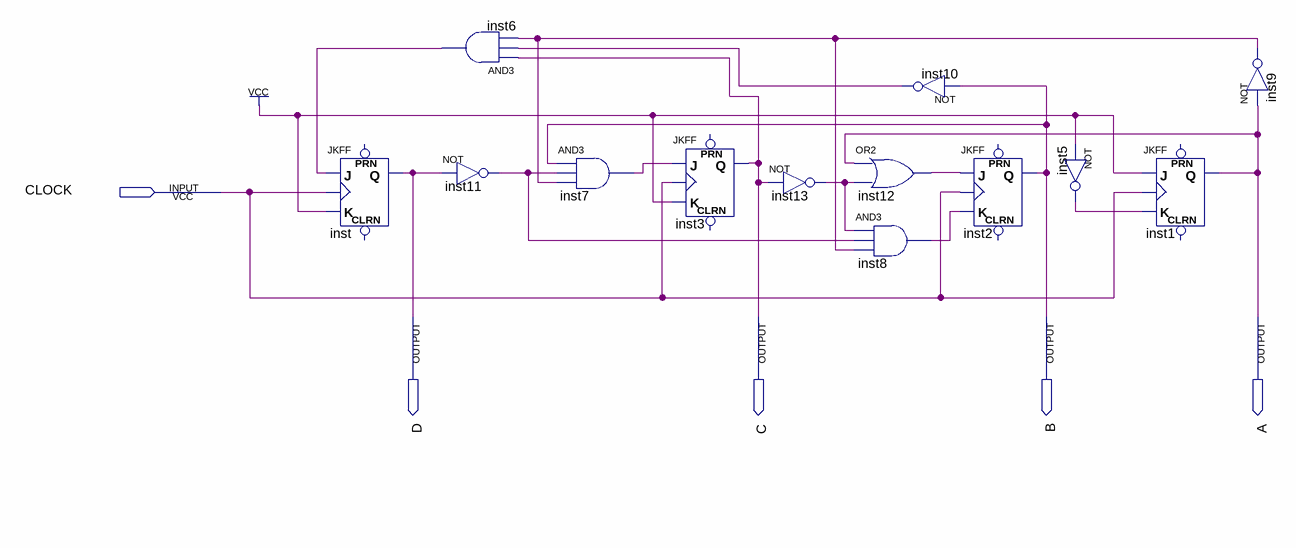
[diagram p0: schematic sheet]
// Quartus schematic LAB4_HocBu2.bdf as structural Verilog: 13 symbols, 5 pins
module LAB4_HocBu2 (
  input  CLOCK,
  output D,
  output C,
  output B,
  output A
);

  wire inst5_out, inst6_out, inst7_out, inst8_out, inst9_out, inst10_out, inst11_out, inst12_out, inst13_out;

  JKFF inst (.K(1'b1), .J(inst6_out), .CLK(CLOCK), .Q(D));  // open: PRN, CLRN
  and inst6 (inst6_out, C, inst10_out, inst9_out);
  not inst11 (inst11_out, D);
  and inst7 (inst7_out, B, inst11_out, inst9_out);
  JKFF inst3 (.K(1'b1), .J(inst7_out), .CLK(CLOCK), .Q(C));  // open: PRN, CLRN
  not inst13 (inst13_out, C);
  or inst12 (inst12_out, A, inst13_out);
  and inst8 (inst8_out, inst13_out, inst11_out, inst9_out);
  not inst10 (inst10_out, B);
  JKFF inst2 (.K(inst8_out), .J(inst12_out), .CLK(CLOCK), .Q(B));  // open: PRN, CLRN
  not inst5 (inst5_out, 1'b1);
  JKFF inst1 (.K(inst5_out), .J(1'b1), .CLK(CLOCK), .Q(A));  // open: PRN, CLRN
  not inst9 (inst9_out, A);
endmodule
